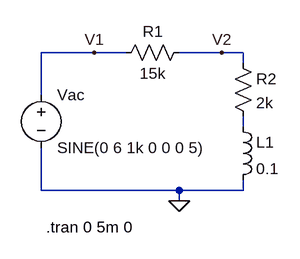
[diagram p0: schematic Banco medicion.asc]
Banco medicion.asc, the LTspice schematic file:
Version 4
SHEET 1 880 680
WIRE 0 128 -80 128
WIRE 48 128 0 128
WIRE 192 128 128 128
WIRE 224 128 192 128
WIRE 224 144 224 128
WIRE -80 192 -80 128
WIRE 224 240 224 224
WIRE -80 336 -80 272
WIRE 128 336 -80 336
WIRE 224 336 224 320
WIRE 224 336 128 336
WIRE 128 352 128 336
FLAG 128 352 0
FLAG 0 128 V1
FLAG 192 128 V2
SYMBOL res 144 112 R90
WINDOW 0 0 56 VBottom 2
WINDOW 3 32 56 VTop 2
SYMATTR InstName R1
SYMATTR Value 15k
SYMBOL ind 208 224 R0
SYMATTR InstName L1
SYMATTR Value 0.1
SYMBOL voltage -80 176 R0
WINDOW 123 0 0 Left 0
WINDOW 39 0 0 Left 0
SYMATTR InstName Vac
SYMATTR Value SINE(0 6 1k 0 0 0 5)
SYMBOL res 208 128 R0
SYMATTR InstName R2
SYMATTR Value 2k
TEXT -72 392 Left 2 !.tran 0 5m 0

The netlist it stands for:
* Banco medicion.asc
R1 V2 V1 15k
L1 N001 0 0.1
Vac V1 0 SINE(0 6 1k 0 0 0 5)
R2 V2 N001 2k
.tran 0 5m 0
.backanno
.end

* Results of the author's LTspice run, read from the files saved beside the schematic
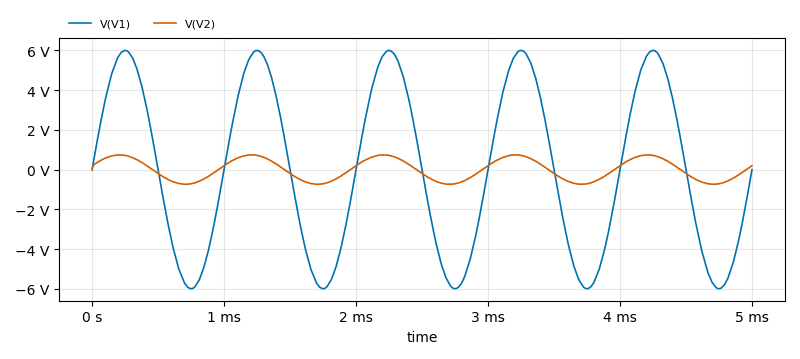
[diagram p1: Transient Analysis of Banco medicion.asc, plotted from the saved traces]
* Transient Analysis, 1 run:
*   V(V1): min -5.999 V, max 5.999 V, average 194.3 µV, rms 4.239 V, last 0 V
*   V(V2): min -738.8 mV, max 738.8 mV, average -220.3 µV, rms 522.1 mV, last 195.4 mV